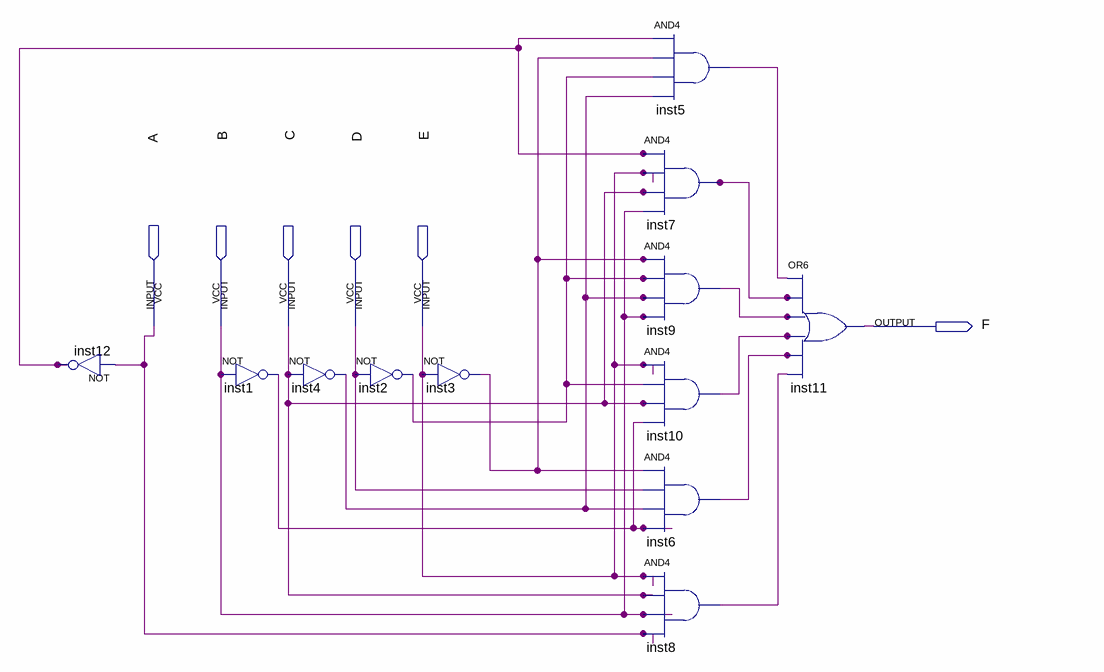
[diagram p0: schematic sheet]
// Quartus schematic Block1.bdf as structural Verilog: 12 symbols, 6 pins
module Block1 (
  input  A,
  input  B,
  input  C,
  input  D,
  input  E,
  output F
);

  wire inst1_out, inst2_out, inst3_out, inst4_out, inst5_out, inst6_out, inst7_out, inst8_out, inst9_out,
       inst10_out, inst12_out;

  not inst12 (inst12_out, A);
  not inst1 (inst1_out, B);
  not inst4 (inst4_out, C);
  not inst2 (inst2_out, D);
  not inst3 (inst3_out, E);
  and inst5 (inst5_out, inst12_out, inst3_out, inst2_out, inst4_out);
  and inst7 (inst7_out, inst12_out, E, C, B);
  and inst9 (inst9_out, inst3_out, inst2_out, inst4_out, B);
  and inst10 (inst10_out, E, inst2_out, C, inst1_out);
  and inst6 (inst6_out, inst3_out, D, inst4_out, inst1_out);
  and inst8 (inst8_out, E, C, B, A);
  or inst11 (F, inst5_out, inst7_out, inst9_out, inst10_out, inst6_out, inst8_out);
endmodule
